# Altium schematic sheet USB-IRIS-W1_MODULE.SchDoc
size A3; Date: 7/24/2020; CompanyName: U-blox; DrawnBy: EMOO; Engineer: EMOO; Organization: U-blox; Address1: 3950 Fairview Industrial Dr SE #100; Address2: Salem, OR 97302; DocumentNumber: 3; SheetNumber: 4; SheetTotal: 4; SheetSize: B; SheetTitle: Connectors
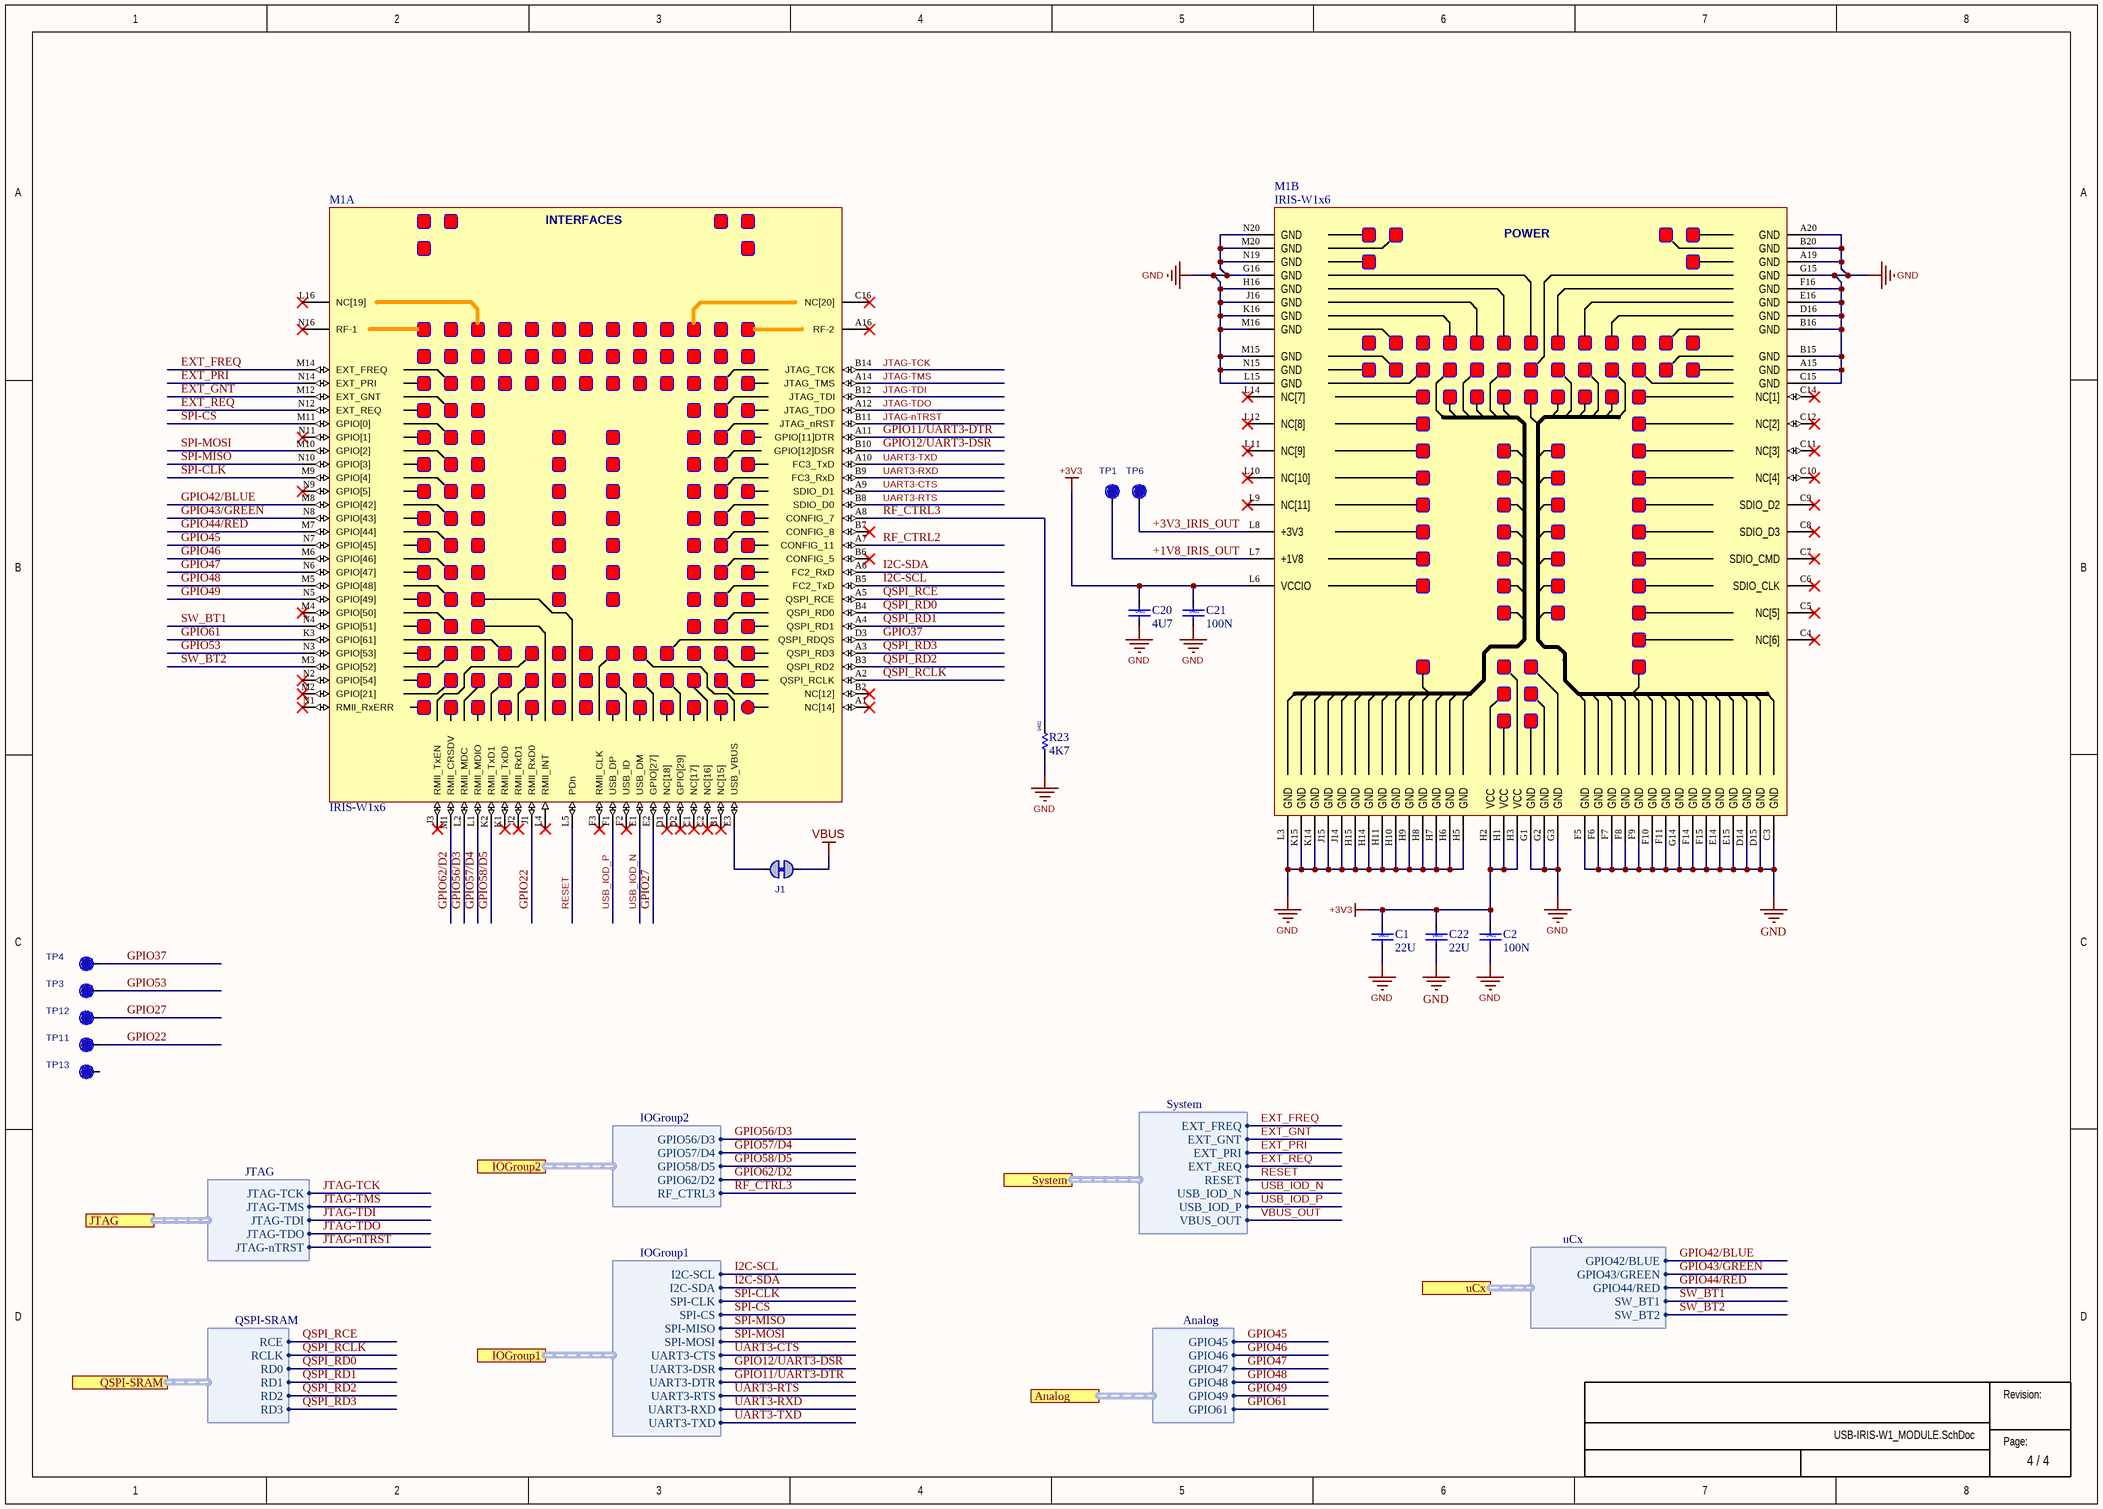
[diagram p0: USB-IRIS-W1_MODULE.SchDoc]

## Parts
C1  value 22U  Size: 0603  [Cap 0603]
C2  value 100N  Size: 0402  [Cap 0402 HD]
C20  value 4U7  Size: 0402  [Cap_0402_1200Lx700Wx700H_600x600Pad_350G_FLX]
C21  value 100N  Size: 0402  [Cap 0402 HD]
C22  value 22U  Size: 0603  [Cap 0603]
J1  Solderbridge-ShortDNP  [Solderbridge-Short]  (value not drawn)  (net tie, no BOM)
M1  IRIS-W1x6  [IRIS-W1x6_LGA152]  (parts A,B of 2)
R23  value 4K7  Size: 0402  [RES_0402_1100Lx600Wx400H_500x600Pad_400G_FLX]
TP1  TP  [TP10R]  (value not drawn)  (no BOM)
TP3  TP  [TP10R]  (value not drawn)  (no BOM)
TP4  TP  [TP10R]  (value not drawn)  (no BOM)
TP6  TP  [TP10R]  (value not drawn)  (no BOM)
TP11  TP  [TP10R]  (value not drawn)  (no BOM)
TP12  TP  [TP10R]  (value not drawn)  (no BOM)
TP13  TP  [TP10R]  (value not drawn)  (no BOM)

## Ports
Analog (harness Analog), IOGroup1 (harness IOGroup1), IOGroup2 (harness IOGroup2), JTAG (harness JTAG), QSPI-SRAM (harness QSPI-SRAM), System (harness System), uCx (harness uCx)

## Harnesses
JTAG: JTAG-TCK, JTAG-TMS, JTAG-TDI, JTAG-TDO, JTAG-nTRST
QSPI-SRAM: RCE, RCLK, RD0, RD1, RD2, RD3
Analog: GPIO45, GPIO46, GPIO47, GPIO48, GPIO49, GPIO61
uCx: GPIO42/BLUE, GPIO43/GREEN, GPIO44/RED, SW_BT1, SW_BT2
IOGroup1: I2C-SCL, I2C-SDA, SPI-CLK, SPI-CS, SPI-MISO, SPI-MOSI, UART3-CTS, UART3-DSR, UART3-DTR, UART3-RTS, UART3-RXD, UART3-TXD
System: EXT_FREQ, EXT_GNT, EXT_PRI, EXT_REQ, RESET, USB_IOD_N, USB_IOD_P, VBUS_OUT
IOGroup2: GPIO56/D3, GPIO57/D4, GPIO58/D5, GPIO62/D2, RF_CTRL3

## Nets
+3V3: C1.1 C2.1 C20.1 C21.1 C22.1 M1.H1(VCC) M1.H2(VCC) M1.H3(VCC) M1.L6(VCCIO)
GND: C1.2 C2.2 C20.2 C21.2 C22.2 M1.A15(GND) M1.A19(GND) M1.A20(GND) M1.B15(GND) M1.B16(GND) M1.B20(GND) M1.C3(GND) M1.C15(GND) M1.D14(GND) M1.D15(GND) M1.D16(GND) M1.E14(GND) M1.E15(GND) M1.E16(GND) M1.F5(GND) M1.F6(GND) M1.F7(GND) M1.F8(GND) M1.F9(GND) M1.F10(GND) M1.F11(GND) M1.F14(GND) M1.F15(GND) M1.F16(GND) M1.G1(GND) M1.G2(GND) M1.G3(GND) M1.G14(GND) M1.G15(GND) M1.G16(GND) M1.H5(GND) M1.H6(GND) M1.H7(GND) M1.H8(GND) M1.H9(GND) M1.H10(GND) M1.H11(GND) M1.H14(GND) M1.H15(GND) M1.H16(GND) M1.J14(GND) M1.J15(GND) M1.J16(GND) M1.K14(GND) M1.K15(GND) M1.K16(GND) M1.L3(GND) M1.L15(GND) M1.M15(GND) M1.M16(GND) M1.M20(GND) M1.N15(GND) M1.N19(GND) M1.N20(GND) R23.1
VBUS: J1.1
+1V8_IRIS_OUT: M1.L7(+1V8) TP1.1
+3V3_IRIS_OUT: M1.L8(+3V3) TP6.1
EXT_FREQ: M1.M14(EXT_FREQ) ; port System.EXT_FREQ
EXT_GNT: M1.M12(EXT_GNT) ; port System.EXT_GNT
EXT_PRI: M1.N14(EXT_PRI) ; port System.EXT_PRI
EXT_REQ: M1.N12(EXT_REQ) ; port System.EXT_REQ
GPIO11/UART3-DTR: M1.A11(GPIO[11]DTR) ; port IOGroup1.UART3-DTR
GPIO12/UART3-DSR: M1.B10(GPIO[12]DSR) ; port IOGroup1.UART3-DSR
GPIO22: M1.J1(RMII_RxD0) TP11.1
GPIO27: M1.E2(GPIO[27]) TP12.1
GPIO37: M1.D3(QSPI_RDQS) TP4.1
GPIO42/BLUE: M1.M8(GPIO[42]) ; port uCx.GPIO42/BLUE
GPIO43/GREEN: M1.N8(GPIO[43]) ; port uCx.GPIO43/GREEN
GPIO44/RED: M1.M7(GPIO[44]) ; port uCx.GPIO44/RED
GPIO45: M1.N7(GPIO[45]) ; port Analog.GPIO45
GPIO46: M1.M6(GPIO[46]) ; port Analog.GPIO46
GPIO47: M1.N6(GPIO[47]) ; port Analog.GPIO47
GPIO48: M1.M5(GPIO[48]) ; port Analog.GPIO48
GPIO49: M1.N5(GPIO[49]) ; port Analog.GPIO49
GPIO53: M1.N3(GPIO[53]) TP3.1
GPIO56/D3: M1.L2(RMII_MDC) ; port IOGroup2.GPIO56/D3
GPIO57/D4: M1.L1(RMII_MDIO) ; port IOGroup2.GPIO57/D4
GPIO58/D5: M1.K2(RMII_TxD1) ; port IOGroup2.GPIO58/D5
GPIO61: M1.K3(GPIO[61]) ; port Analog.GPIO61
GPIO62/D2: M1.M1(RMII_CRSDV) ; port IOGroup2.GPIO62/D2
I2C-SCL: M1.B5(FC2_TxD) ; port IOGroup1.I2C-SCL
I2C-SDA: M1.A6(FC2_RxD) ; port IOGroup1.I2C-SDA
JTAG-nTRST: M1.B11(JTAG_nRST) ; port JTAG.JTAG-nTRST
JTAG-TCK: M1.B14(JTAG_TCK) ; port JTAG.JTAG-TCK
JTAG-TDI: M1.B12(JTAG_TDI) ; port JTAG.JTAG-TDI
JTAG-TDO: M1.A12(JTAG_TDO) ; port JTAG.JTAG-TDO
JTAG-TMS: M1.A14(JTAG_TMS) ; port JTAG.JTAG-TMS
QSPI_RCE: M1.A5(QSPI_RCE) ; port QSPI-SRAM.RCE
QSPI_RCLK: M1.A2(QSPI_RCLK) ; port QSPI-SRAM.RCLK
QSPI_RD0: M1.B4(QSPI_RD0) ; port QSPI-SRAM.RD0
QSPI_RD1: M1.A4(QSPI_RD1) ; port QSPI-SRAM.RD1
QSPI_RD2: M1.B3(QSPI_RD2) ; port QSPI-SRAM.RD2
QSPI_RD3: M1.A3(QSPI_RD3) ; port QSPI-SRAM.RD3
RESET: M1.L5(PDn) ; port System.RESET
RF_CTRL2: M1.A7(CONFIG_11)
RF_CTRL3: M1.A8(CONFIG_7) R23.2 ; port IOGroup2.RF_CTRL3
SPI-CLK: M1.M9(GPIO[4]) ; port IOGroup1.SPI-CLK
SPI-CS: M1.M11(GPIO[0]) ; port IOGroup1.SPI-CS
SPI-MISO: M1.N10(GPIO[3]) ; port IOGroup1.SPI-MISO
SPI-MOSI: M1.M10(GPIO[2]) ; port IOGroup1.SPI-MOSI
SW_BT1: M1.N4(GPIO[51]) ; port uCx.SW_BT1
SW_BT2: M1.M3(GPIO[52]) ; port uCx.SW_BT2
UART3-CTS: M1.A9(SDIO_D1) ; port IOGroup1.UART3-CTS
UART3-RTS: M1.B8(SDIO_D0) ; port IOGroup1.UART3-RTS
UART3-RXD: M1.B9(FC3_RxD) ; port IOGroup1.UART3-RXD
UART3-TXD: M1.A10(FC3_TxD) ; port IOGroup1.UART3-TXD
USB_IOD_N: M1.E1(USB_DM) ; port System.USB_IOD_N
USB_IOD_P: M1.F1(USB_DP) ; port System.USB_IOD_P
VBUS_OUT: port System.VBUS_OUT
NetJ1_2: J1.2 M1.E3(USB_VBUS)

Not connected (* = marked no-connect by the designer): M1 A1(NC[14])* A16(RF-2)* B1(NC[15])* B2(NC[12])* B6(CONFIG_5)* B7(CONFIG_8)* C1(NC[17])* C2(NC[16])* C4(NC[6])* C5(NC[5])* C6(SDIO_CLK)* C7(SDIO_CMD)* C8(SDIO_D3)* C9(SDIO_D2)* C10(NC[4])* C11(NC[3])* C12(NC[2])* C14(NC[1])* C16(NC[20])* D1(NC[18])* D2(GPIO[29])* F2(USB_ID)* F3(RMII_CLK)* J2(RMII_RxD1)* J3(RMII_TxEN)* K1(RMII_TxD0)* L4(RMII_INT)* L9(NC[11])* L10(NC[10])* L11(NC[9])* L12(NC[8])* L14(NC[7])* L16(NC[19])* M2(GPIO[21])* M4(GPIO[50])* N1(RMII_RxERR)* N2(GPIO[54])* N9(GPIO[5])* N11(GPIO[1])* N16(RF-1)*; TP13 1

## Notes on the sheet
- Revision:
- Page:
- (in symbol UBXH14-0000681, part A) INTERFACES
- (in symbol UBXH14-0000681, part B) POWER

## Library data of the parts
C1 C22 = UBXH01-0000150: CAP CER X5R 0603 22U 20% 10V; Manufacturer: Murata Manufacturing Company, Ltd.; Manufacturer P/N: GRM188R61A226ME15D; Editor: dario.antonaz; Released by: pasquale.scorca; Env: ROHS; Permitted Use: Volume Products; Perferred: PREF; Mfg P/N Status: Active; Mfg P/N Split: 100; Mfg P/N Released: Yes; Part Number: UBXH01-0000150; Tolerance: 20%; Max Voltage: 10V; Part Type: Capacitor; Release Data: 2016-03-09T11:21:55; UBX Wiki: https://wiki.u-blox.com/bin/view/Operations/PartDetails?index=21275; RefDes: C; Mfg P/N Datasheet: https://wiki.u-blox.com/bin/view/Generic/Docs/DocumentSummary?index=21277
C2 C21 = UBXH01-2021002: CAP CER X5R 0402 100N 10% 10V; Manufacturer: Murata Manufacturing Company, Ltd.; Manufacturer P/N: GRM155R61A104KA01; Editor: roland.rust; Env: GREEN; Permitted Use: Volume Products; Perferred: PREF; Mfg P/N Status: NRND; Mfg P/N Split: 100; Mfg P/N Released: Yes; Part Number: UBXH01-2021002; Tolerance: 10%; Max Voltage: 10V; Part Type: Capacitor; Released by: roland.rust; Release Data: 2005-07-22T13:59:44; UBX Wiki: https://wiki.u-blox.com/bin/view/Operations/PartDetails?index=5759; RefDes: C; Manufacturer 2: Samsung Electro-Mechanics; Manufacturer P/N 2: CL05A104KP5NNN; Mfg P/N Status 2: Active; Mfg P/N Split 2: 0; Mfg P/N Released 2: Yes; Mfg P/N Datasheet 2: https://wiki.u-blox.com/bin/view/Generic/Docs/DocumentSummary?index=28113
C20 = UBXH01-0000243: CAP CER X5R 0402 4U7 20% 10V; Manufacturer: Murata Manufacturing Company, Ltd.; Manufacturer P/N: GRM155R61A475MEAA; Editor: martin.pilik; Released by: fabrice.bret-dibat; Env: GREEN; Permitted Use: Volume Products; Perferred: PREF; Mfg P/N Status: Active; Mfg P/N Split: 100; Mfg P/N Released: Yes; Part Number: UBXH01-0000243; Tolerance: 20%; Max Voltage: 10V; Min Operating Temp: -40°C; Max Operating Temp: 85°C; Part Type: Capacitor; Release Data: 2021-05-10T12:57:47; UBX Wiki: https://wiki.u-blox.com/bin/view/Operations/PartDetails?index=24303; RefDes: C; Mfg P/N Datasheet: https://wiki.u-blox.com/bin/view/Generic/Docs/DocumentSummary?index=24302
J1 = Solderbridge-Short: Added By: Paul B; Part Number: Solderbridge-Short; Height: 0; DNP: DNP; Added Date: 12/2/2015
M1 = UBXH14-0000681: SHORT RANGE STAND-ALONE MULTIRADIO MODULE U-BLOX IRIS-W106; Editor: olof.viklund; Env: ROHS; Permitted Use: Volume Products; Perferred: PREF; Part Number: UBXH14-0000681; Min Operating Temp: -40°C; Max Operating Temp: 85°C; Part Type: RF; UBX Wiki: https://wiki.u-blox.com/bin/view/Operations/PartDetails?index=38240; RefDes: A
R23 = UBXH18-0008065: RES THICK FILM CHIP 0402 4K7 5% 100mW; Manufacturer: YAGEO; Manufacturer P/N: 2322_705_70472_L; Editor: martin.frauchiger; Env: ROHS; Permitted Use: Volume Products; Perferred: PREF; Mfg P/N Status: NRND; Mfg P/N Split: 100; Mfg P/N Released: Yes; Part Number: UBXH18-0008065; Tolerance: 5%; Max Power: 100mW; Part Type: Resistor; Released by: martin.frauchiger; Release Data: 2005-08-19T10:42:45; UBX Wiki: https://wiki.u-blox.com/bin/view/Operations/PartDetails?index=6969; RefDes: R; Manufacturer 2: KOA; Manufacturer P/N 2: RK73B1ETTD472J; Mfg P/N Status 2: NRND; Mfg P/N Split 2: 0; Mfg P/N Released 2: Yes
TP1 TP3 TP4 TP6 TP11-TP13 = TP10R: Testpoint, Round 1.0mm Dia; Added By: Jeremy D; Part Number: TP10R; Size: 1.0mm; Height: 0; DNP: DNP; Added Date: 2/1/2015; Checked By: Paul B; Checked Date: 2/5/2015